# EAGLE design square Rev3 (EAGLE 9.0.1)
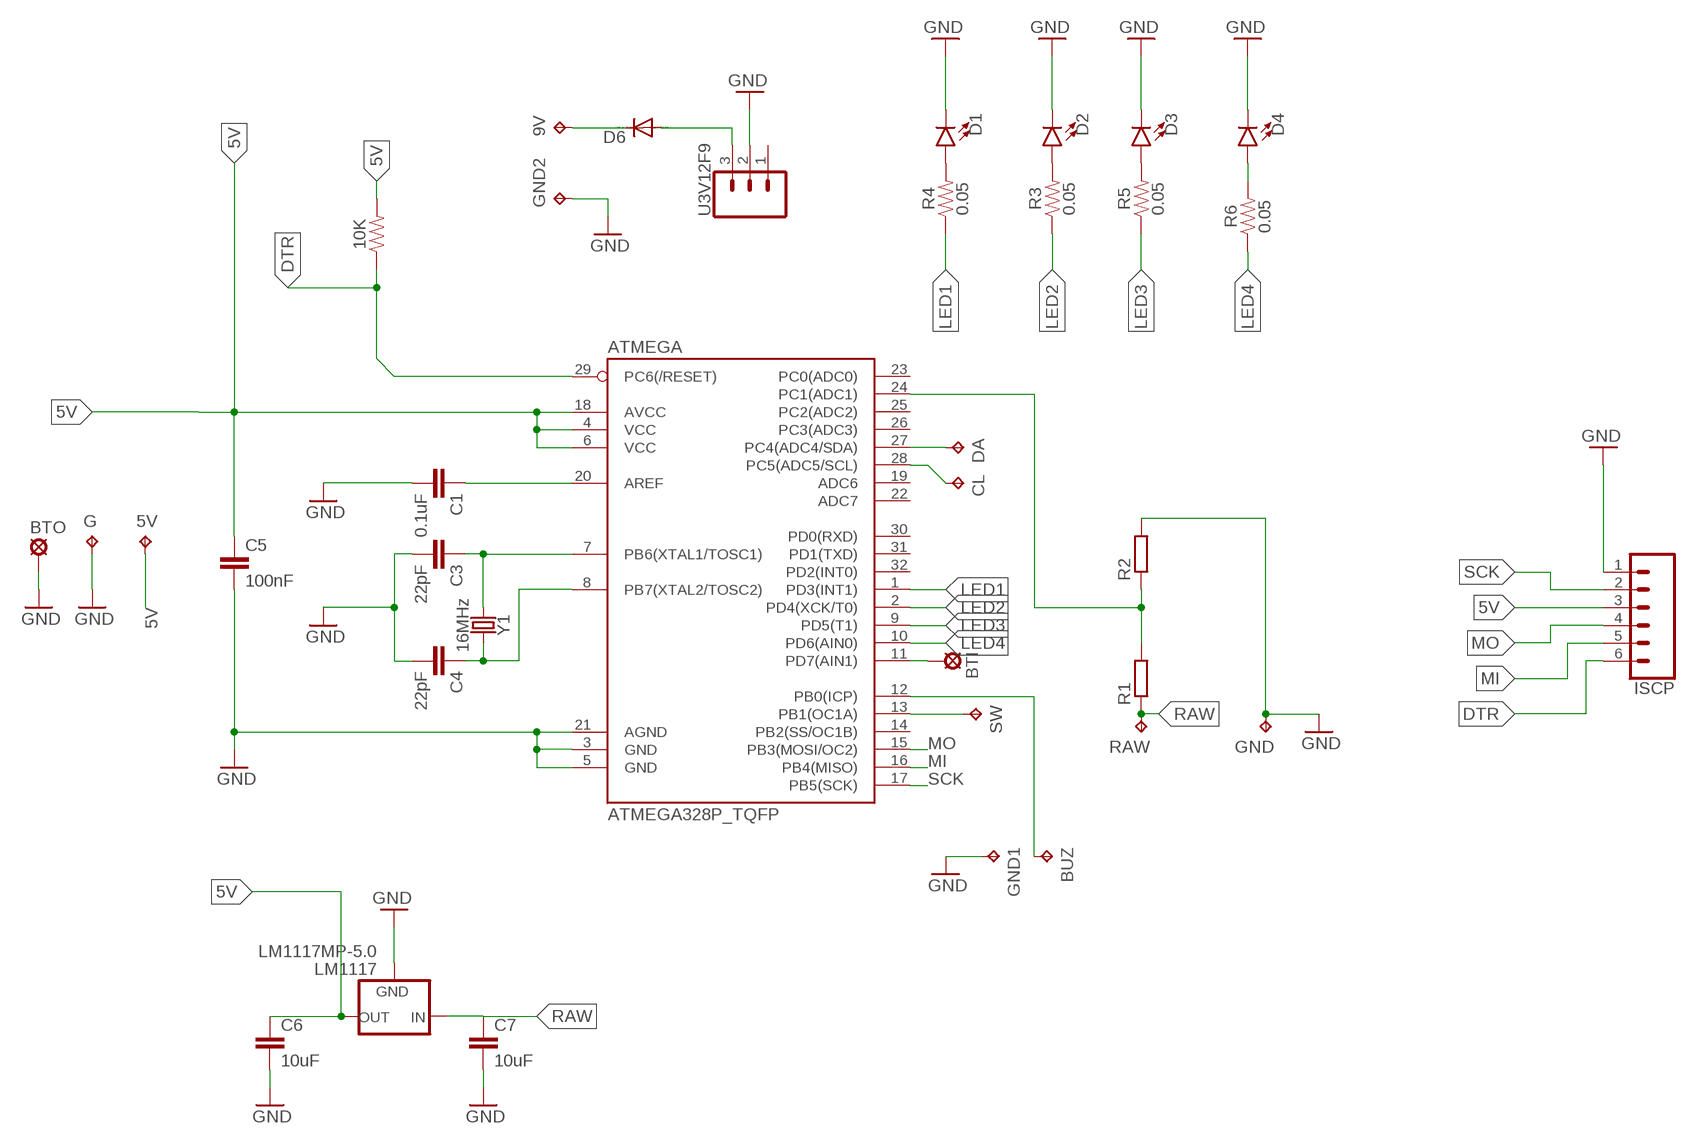
[diagram p0: schematic, sheet 1]

## Parts
5V  TPB1,27  [B1,27]
9V  TPB2,54  [B2,54]
10K  0.27OHM-0603-1/10W-1%  [0603]
ATMEGA  ATMEGA328P_TQFP  [TQFP32-08]
BTI  LSP10  [LSP10]
BTO  LSP10  [LSP10]
BUZ  TPB2,54  [B2,54]
C1  0.1uF  10NF-0603-50V-10%  [0603]
C3  22pF  10NF-0603-50V-10%  [0603]
C4  22pF  10NF-0603-50V-10%  [0603]
C5  100nF  10NF-0603-50V-10%  [0603]
C6  10uF  10UF-1206-6.3V-20%  [1206]
C7  10uF  C-EUC1206  [C1206]
CL  TPB1,27  [B1,27]
D1  LED1206  [LED-1206]
D2  LED1206  [LED-1206]
D3  LED1206  [LED-1206]
D4  LED1206  [LED-1206]
D6  DIODE-SOD106A-R  [SOD106A-R]
DA  TPB1,27  [B1,27]
G  TPB1,27  [B1,27]
GND  TPB2,54  [B2,54]
GND1  TPB2,54  [B2,54]
GND2  TPB2,54  [B2,54]
ISCP  CONN_06SMD-1MM  [1X06-1MM]
LM1117  LM1117MP-5.0  [SOT223]
R1  R-EU_R1206  [R1206]
R2  R-EU_R1206  [R1206]
R3  0.05  0.05OHM-0603-1/5W-1%  [0603]
R4  0.05  0.05OHM-0603-1/5W-1%  [0603]
R5  0.05  0.05OHM-0603-1/5W-1%  [0603]
R6  0.05  0.05OHM-0603-1/5W-1%  [0603]
RAW  TPB2,54  [B2,54]
SW  TPB1,27  [B1,27]
U3V12F9  CONN_03  [1X03]
Y1  16MHz  CRYSTALSMD-5X3.2-2PAD  [CRYSTAL-SMD-5X3.2-2PAD]

## Nets
5V [power]: 5V.TP 10K.2 ATMEGA.4(VCC) ATMEGA.6(VCC) ATMEGA.18(AVCC) C5.1 C6.1 ISCP.3 LM1117.2(OUT) LM1117.4(OUT)
9VOUT [9v]: D6.A U3V12F9.3
AREF: ATMEGA.20(AREF) C1.1
BUTTON: ATMEGA.11(PD7(AIN1)) BTI.MP
BUZZER: ATMEGA.12(PB0(ICP)) BUZ.TP
DTR: 10K.1 ATMEGA.29(PC6(/RESET)) ISCP.6
GND [power]: ATMEGA.3(GND) ATMEGA.5(GND) ATMEGA.21(AGND) BTO.MP C1.2 C3.2 C4.2 C5.2 C6.2 C7.2 D1.C D2.C D3.C D4.C G.TP GND1.TP GND2.TP GND.TP ISCP.1 LM1117.1(GND) R2.2 U3V12F9.2
GREEN1: D2.A R3.2
GREEN2: D3.A R5.2
GREEN3: D4.A R6.2
LED1: ATMEGA.1(PD3(INT1)) R4.1
LED2: ATMEGA.2(PD4(XCK/T0)) R3.1
LED3: ATMEGA.9(PD5(T1)) R5.1
LED4: ATMEGA.10(PD6(AIN0)) R6.1
MI: ATMEGA.16(PB4(MISO)) ISCP.5
MO: ATMEGA.15(PB3(MOSI/OC2)) ISCP.4
N$2: ATMEGA.13(PB1(OC1A)) SW.TP
N$21 [9v]: 9V.TP D6.C
RAW [9v]: C7.1 LM1117.3(IN) R1.1 RAW.TP
RED: D1.A R4.2
SCK: ATMEGA.17(PB5(SCK)) ISCP.2
SCL: ATMEGA.28(PC5(ADC5/SCL)) CL.TP
SDA: ATMEGA.27(PC4(ADC4/SDA)) DA.TP
VOLTSENS: ATMEGA.24(PC1(ADC1)) R1.2 R2.1
XTAL1: ATMEGA.7(PB6(XTAL1/TOSC1)) C3.1 Y1.P$1
XTAL2: ATMEGA.8(PB7(XTAL2/TOSC2)) C4.1 Y1.P$2
Unconnected: ATMEGA.14(PB2(SS/OC1B)) ATMEGA.19(ADC6) ATMEGA.22(ADC7) ATMEGA.23(PC0(ADC0)) ATMEGA.25(PC2(ADC2)) ATMEGA.26(PC3(ADC3)) ATMEGA.30(PD0(RXD)) ATMEGA.31(PD1(TXD)) ATMEGA.32(PD2(INT0)) U3V12F9.1

## Library data of the parts
5V 9V BUZ CL DA G GND GND1 GND2 RAW SW = testpad:TP: Test pad
10K = SparkFun-Resistors:0.27OHM: 0.27Ω resistor A resistor is a passive two-terminal electrical component that implements electrical resistance as a circuit element. Resistors act to reduce current flow, and, at the same time, act to lower voltage levels within circuits. - Wikipedia; PROD_ID: RES-08787; VALUE: 0.27
ATMEGA = SparkFun-IC-Microcontroller:ATMEGA328P_TQFP: Popular 328P in QFP Storefront component: ATmega328 - TQFP <https://www.sparkfun.com/products/13448> (COM-13448) Datasheet <http://www.sparkfun.com/datasheets/Components/SMD/ATMega328.pdf> SparkFun Products SparkFun RedBoard - Programmed with Arduino <https://www.sparkfun.com/products/12757> (DEV-12757) Arduino Pro Mini 328 - 5V/16MHz <https://www.sparkfun.com/products/11113> (DEV-11113) Arduino Pro Mini 328 - 3.3V/8MHz <https://www.sparkfun.com/products/11114> (DEV-11114) SparkFun OpenLog <https://www.sparkfun.com/products/13712> (DEV-13712) SparkFun MicroView - OLED Arduino Module <https://www.sparkfun.com/products/12923> (DEV-12923) SparkFun Digital Sandbox <https://www.sparkfun.com/products/12651> (DEV-12651) SparkFun PicoBoard <https://www.sparkfun.com/products/11888> (WIG-11888) Arduino Fio <https://www.sparkfun.com/products/10116> (DEV-10116) LilyPad Arduino 328 Main Board <https://www.sparkfun.com/products/13342> (DEV-13342) SparkFun RedStick <https://www.sparkfun.com/products/13741> (DEV-13741) LilyPad MP3 <https://www.sparkfun.com/products/11013> (DEV-11013) LilyPad Arduino SimpleSnap <https://www.sparkfun.com/products/10941> (DEV-10941) SparkFun Stepoko <https://www.sparkfun.com/products/13899> (ROB-13899) SparkFun Geiger Counter <https://www.sparkfun.com/products/11345> (SEN-11345) SparkFun EL Sequencer <https://www.sparkfun.com/products/12781> (COM-12781) Arduino Pro 328 - 5V/16MHz <https://www.sparkfun.com/products/10915> (DEV-10915) CryptoCape <https://www.sparkfun.com/products/12773> (DEV-12773) SparkFun IR Thermometer Evaluation Board - MLX90614 <https://www.sparkfun.com/products/10740> (SEN-10740) SparkFun RedBot Mainboard <https://www.sparkfun.com/products/12097> (ROB-12097) Arduino Pro 328 - 3.3V/8MHz <https://www.sparkfun.com/products/10914> (DEV-10914) SparkFun Block for Intel® Edison - Arduino <https://www.sparkfun.com/products/13036> (DEV-13036) SparkFun Simon Says - Surface Mount Soldering Kit <https://www.sparkfun.com/products/10935> (KIT-10935) SparkFun 7-Segment Serial Display - Red <https://www.sparkfun.com/products/11441> (COM-11441) SparkFun 7-Segment Serial Display - White <https://www.sparkfun.com/products/11629> (COM-11629) SparkFun 7-Segment Serial Display - Yellow <https://www.sparkfun.com/products/11443> (COM-11443) SparkFun 7-Segment Serial Display - Kelly Green <https://www.sparkfun.com/products/11440> (COM-11440) SparkFun 7-Segment Serial Display - Blue <https://www.sparkfun.com/products/11442> (COM-11442) SparkFun OpenSegment Serial Display - 20mm (Blue) <https://www.sparkfun.com/products/11647> (COM-11647) SparkFun OpenSegment Serial Display - 20mm (Green) <https://www.sparkfun.com/products/11646> (COM-11646) SparkFun OpenSegment Serial Display - 20mm (White) <https://www.sparkfun.com/products/11648> (COM-11648) SparkFun OpenSegment Serial Display - 20mm (Red) <https://www.sparkfun.com/products/11644> (COM-11644) SparkFun OpenSegment Serial Display - 20mm (Yellow) <https://www.sparkfun.com/products/11645> (COM-11645) SparkFun OpenSegment Shield <https://www.sparkfun.com/products/13190> (DEV-13190); PROD_ID: IC-09069
BTI BTO = solpad:LSP10: SOLDER PAD drill 1.0 mm, distributor Buerklin, 12H555
C1 C3-C5 = SparkFun-Capacitors:10NF: 0.01uF/10nF/10,000pF ceramic capacitors A capacitor is a passive two-terminal electrical component used to store electrical energy temporarily in an electric field. CAP-09321; PROD_ID: CAP-00867; VALUE: 10nF
C6 = SparkFun-Capacitors:10UF: 10.0µF ceramic capacitors A capacitor is a passive two-terminal electrical component used to store electrical energy temporarily in an electric field.; PROD_ID: CAP-10057
C7 = rcl:C-EU: CAPACITOR, European symbol; SPICEPREFIX: C
D1-D4 = SparkFun-LED:LED: LED (Generic) Standard schematic elements and footprints for 5mm, 3mm, 1206, and 0603 sized LEDs. Generic LEDs with no color specified.
D6 = diode:DIODE-: DIODE
ISCP = SparkFun-Connectors:CONN_06: Multi connection point. Often used as Generic Header-pin footprint for 0.1 inch spaced/style header connections On any of the 0.1 inch spaced packages, you can populate with these: Break Away Headers - Straight <https://www.sparkfun.com/products/116> (PRT-00116) Break Away Male Headers - Right Angle <https://www.sparkfun.com/products/553> (PRT-00553) Female Headers <https://www.sparkfun.com/products/115> (PRT-00115) Break Away Headers - Machine Pin <https://www.sparkfun.com/products/117> (PRT-00117) Break Away Female Headers - Swiss Machine Pin <https://www.sparkfun.com/products/743> (PRT-00743) Arduino Stackable Header - 6 Pin <https://www.sparkfun.com/products/9280> (PRT-09280) For SCREWTERMINALS and SPRING TERMINALS visit here: Screw Terimnals on SparkFun.com <https://www.sparkfun.com/search/results?term=Screw+Terminals> (5mm/3.5mm/2.54mm spacing) This device is also useful as a general connection point to wire up your design to another part of your project. Our various solder wires solder well into these plated through hole pads. Hook-Up Wire - Assortment (Stranded, 22 AWG) <https://www.sparkfun.com/products/11375> (PRT-11375) Hook-Up Wire - Assortment (Solid Core, 22 AWG) <https://www.sparkfun.com/products/11367> (PRT-11367) View the entire wire category on our website here <https://www.sparkfun.com/categories/141>; PROD_ID: CONN-08249; SF_ID: GPS-00579
LM1117 = lm1117_10:LM1117?-*: 800mA Low-Dropout Linear Regulator Source: http://www.ti.com/lit/ds/symlink/lm1117-n.pdf; MF: Texas Instruments; MPN: LM1117MP-5.0; OC_FARNELL: 9778209; OC_NEWARK: 28X3417
R1 R2 = Clean-Kong:R-EU_: RESISTOR, European symbol
R3-R6 = SparkFun-Resistors:0.05OHM: 0.05Ω resistor A resistor is a passive two-terminal electrical component that implements electrical resistance as a circuit element. Resistors act to reduce current flow, and, at the same time, act to lower voltage levels within circuits. - Wikipedia; PROD_ID: RES-12535
U3V12F9 = SparkFun-Connectors:CONN_03: Multi connection point. Often used as Generic Header-pin footprint for 0.1 inch spaced/style header connections On any of the 0.1 inch spaced packages, you can populate with these: Break Away Headers - Straight <https://www.sparkfun.com/products/116> (PRT-00116) Break Away Male Headers - Right Angle <https://www.sparkfun.com/products/553> (PRT-00553) Female Headers <https://www.sparkfun.com/products/115> (PRT-00115) Break Away Headers - Machine Pin <https://www.sparkfun.com/products/117> (PRT-00117) Break Away Female Headers - Swiss Machine Pin <https://www.sparkfun.com/products/743> (PRT-00743) Stackable Header - 3 Pin (Female, 0.1") <https://www.sparkfun.com/products/13875> (PRT-13875) For SCREWTERMINALS and SPRING TERMINALS visit here: Screw Terimnals on SparkFun.com <https://www.sparkfun.com/search/results?term=Screw+Terminals> (5mm/3.5mm/2.54mm spacing) This device is also useful as a general connection point to wire up your design to another part of your project. Our various solder wires solder well into these plated through hole pads. Hook-Up Wire - Assortment (Stranded, 22 AWG) <https://www.sparkfun.com/products/11375> (PRT-11375) Hook-Up Wire - Assortment (Solid Core, 22 AWG) <https://www.sparkfun.com/products/11367> (PRT-11367) View the entire wire category on our website here <https://www.sparkfun.com/categories/141> Special notes: Molex polarized connector foot print use with SKU : PRT-08232 with associated crimp pins and housings.
Y1 = SparkFun-Clocks:CRYSTAL: Crystals (Generic) These are passive quartz crystals, which can be used as a clock source for a microcontroller. Crystal's are two-terminal devices. They require external "load" capacitors to generate an oscillating signal.

## Module VCC
Ports: 

### Library data of the parts

## Net classes
0 default: width 0.254 mm, drill 0.254 mm, clearance 0.229 mm
1 power: width 0.305 mm, drill 0.3 mm, clearance 0.305 mm
2 9v: width 0.399 mm, drill 0.399 mm, clearance 0.3 mm

## Board
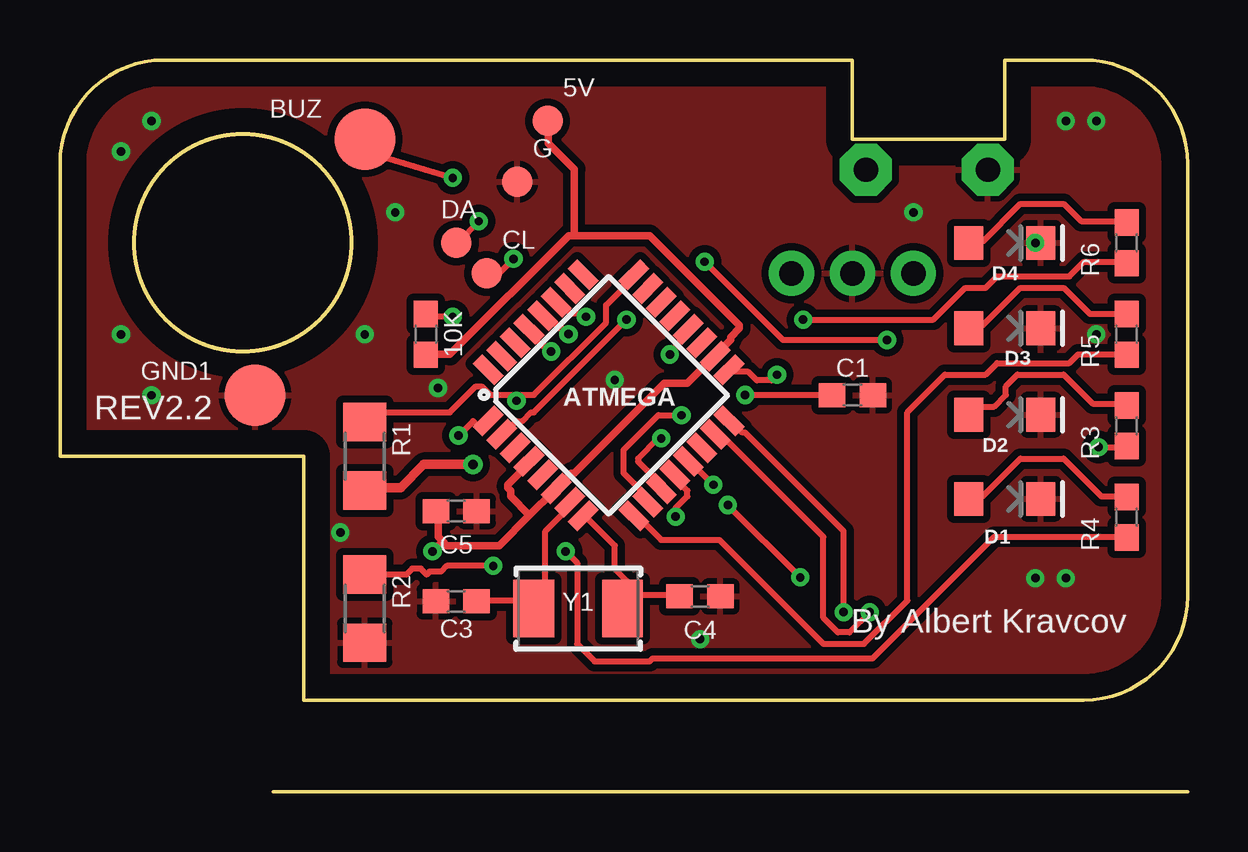
[diagram p1: board, top side]
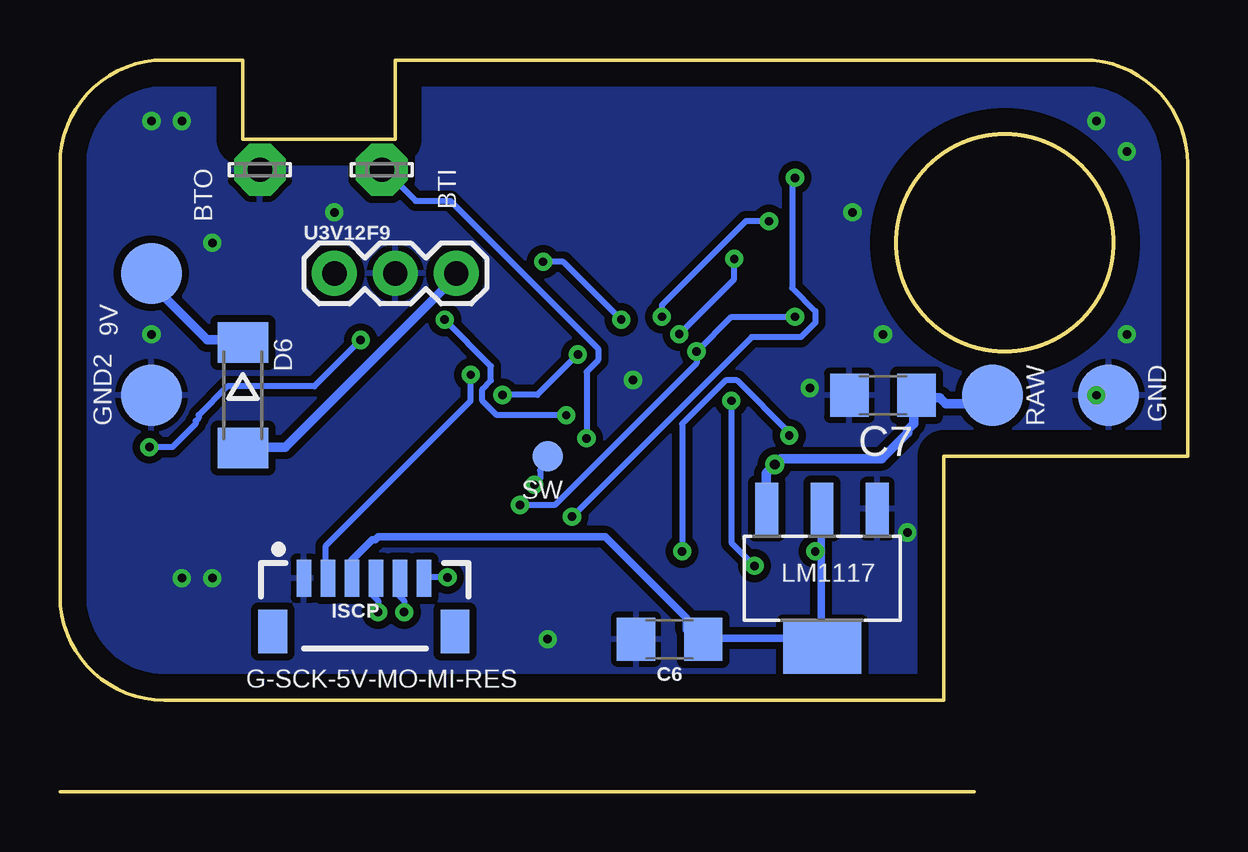
[diagram p2: board, bottom side, seen from below]

Size 46.99 x 30.48 mm. Coordinates in mm from the lower left corner, seen from the top.
Outline: 0,13.97 0,26.14 arc-90 4.34,30.48 33.02,30.48 33.02,27.18 39.37,27.18 39.37,30.48 42.65,30.48 arc-90 46.99,26.14 46.99,8.15 arc-90 42.65,3.81 10.16,3.81 10.16,13.97 0,13.97
Outline: circle at 7.62,22.86 radius 4.52
Copper layers (1*16): Top 0.035mm / dielectric 1.5mm / Bottom 0.035mm
Design rules "default *": minimum track width 6mil, minimum drill 0.35mm, track to track 6mil, track to pad 6mil, pad to pad 6mil, via to via 6mil, smd to smd 6mil, copper to edge 40mil, drill to drill 6mil, minimum pad ring 10mil, minimum via ring 8mil, stop-mask expansion 4mil, vias tented up to drill 2mm, thermal gap 10mil

### Footprints (pad centres in the part's own frame; a part is rotated, then mirrored left to right if it is on the bottom)
B1,27 = smd 1.27 x 1.27: TP 0,0
B2,54 = smd 2.54 x 2.54: TP 0,0
0603 = smd 1.1 x 1: 1 -0.85,0; 2 0.85,0
TQFP32-08 = smd 1.27 x 0.559: 1 -4.293,2.8; 2 -4.293,2; 3 -4.293,1.2; 4 -4.293,0.4; 5 -4.293,-0.4; 6 -4.293,-1.2; 7 -4.293,-2; 8 -4.293,-2.8; 17 4.293,-2.8; 18 4.293,-2; 19 4.293,-1.2; 20 4.293,-0.4; 21 4.293,0.4; 22 4.293,1.2; 23 4.293,2; 24 4.293,2.8 | smd 0.559 x 1.27: 9 -2.8,-4.293; 10 -2,-4.293; 11 -1.2,-4.293; 12 -0.4,-4.293; 13 0.4,-4.293; 14 1.2,-4.293; 15 2,-4.293; 16 2.8,-4.293; 25 2.8,4.293; 26 2,4.293; 27 1.2,4.293; 28 0.4,4.293; 29 -0.4,4.293; 30 -1.2,4.293; 31 -2,4.293; 32 -2.8,4.293
LSP10 = drill 1.016 pad 2.159 octagon: MP 0,0
1206 = smd 1.6 x 1.8: 1 -1.4,0; 2 1.4,0
C1206 = smd 1.6 x 1.8: 1 -1.4,0; 2 1.4,0
LED-1206 = smd 1.2 x 1.4: A -1.5,0; C 1.5,0
SOD106A-R = smd 1.7 x 2.1: A 2.2,0; C -2.2,0
1X06-1MM = smd 0.6 x 1.55: 1 -2.54,1.27; 2 -1.54,1.27; 3 -0.54,1.27; 4 0.46,1.27; 5 1.46,1.27; 6 2.46,1.27 | smd 1.2 x 1.8: P$1 -3.84,-0.955; P$2 3.76,-0.955
SOT223 = smd 0.95 x 2.15: 1 -2.3,-2.9; 2 0,-2.9; 3 2.3,-2.9 | smd 3.25 x 2.15: 4 0,2.9
R1206 = smd 1.6 x 1.803: 1 -1.422,0; 2 1.422,0
1X03 = drill 1.016 pad 1.88: 1 0,0; 2 2.54,0; 3 5.08,0
CRYSTAL-SMD-5X3.2-2PAD = smd 1.7 x 2.4: P$1 1.85,0; P$2 -1.85,0

### Placement (x,y rotation side)
5V  20.32,27.94 0 top
9V  43.18,21.59 0 bottom
10K  15.24,19.05 270 top
ATMEGA  22.86,16.51 45 top
BTI  33.58,25.91 0 bottom
BTO  38.66,25.91 0 bottom
BUZ  12.7,27.18 90 top
C1  33.02,16.51 0 top
C3  16.51,7.92 180 top
C4  26.67,8.13 0 top
C5  16.51,11.68 0 top
C6  21.59,6.35 180 bottom
C7  12.7,16.51 180 bottom
CL  17.78,21.59 0 top
D1  39.37,12.19 0 top
D2  39.37,15.7 0 top
D3  39.37,19.3 0 top
D4  39.37,22.86 0 top
D6  39.37,16.51 270 bottom
DA  16.51,22.86 0 top
G  19.05,25.4 0 top
GND  3.3,16.51 0 bottom
GND1  8.13,16.51 90 top
GND2  43.18,16.51 0 bottom
ISCP  34.29,7.62 0 bottom
LM1117  15.24,8.89 180 bottom
R1  12.7,13.97 90 top
R2  12.7,7.62 270 top
R3  44.45,15.24 90 top
R4  44.45,11.43 90 top
R5  44.45,19.05 90 top
R6  44.45,22.86 90 top
RAW  8.13,16.51 180 bottom
SW  26.67,13.97 180 bottom
U3V12F9  35.56,21.59 0 bottom
Y1  21.59,7.62 180 top

### Tracks (layer width: path | path; a pad name or v marks a point on that pad's centre or on a via)
5V  (via drill 0.35)
  Top 0.305: 15.94,10.43 16.12,10.25 18.29,10.25 19.56,11.52 | 15.94,10.43 15.76,10.61 15.76,11.58 C5.1 | 19.56,11.52 20.59,12.54 ATMEGA.6 20.71,12.66 21.31,13.27 21.43,13.27 25.17,17.01 26.14,17.01 27.22,18.09 ATMEGA.18 27.34,18.21 27.95,18.82 27.95,18.94 28.31,19.3 28.31,19.42 24.57,23.16 21.43,23.16 | 19.56,11.52 18.78,12.3 18.78,12.54 18.66,12.66 18.66,12.78 19.26,13.39 19.26,13.51 19.5,13.75 ATMEGA.4 | 21.43,23.16 21.19,23.16 16.24,18.21 15.28,18.21 10K.2 | v15.52,10.01 15.94,10.43 | 21.43,23.16 21.43,25.93 20.34,27.02 20.34,27.86 5V.TP
  Bottom 0.305: ISCP.3 34.82,8.92 34.82,9.65 33.98,10.49 33.86,10.49 33.74,10.61 24.27,10.61 20.89,7.23 20.89,6.75 20.65,6.51 C6.1 19.38,6.39 15.64,6.39 15.28,6.03 LM1117.4 15.64,6.51 15.28,6.87 15.28,10.01 | 15.28,10.01 15.28,11.7 LM1117.2 | v15.52,10.01 15.28,10.01
9VOUT
  Bottom 0.399: U3V12F9.3 30.48,21.47 37.6,14.35 39.29,14.35 D6.A
AREF  (via drill 0.35)
  Top 0.254: v28.55,16.52 32.17,16.52 C1.1 | v25.41,18.21 25.65,18.45 25.65,18.57 26.26,19.18 ATMEGA.20
  Bottom 0.254: v28.55,16.52 27.1,16.52 v25.41,18.21
BUTTON  (via drill 0.35)
  Top 0.254: v25.05,14.71 24.93,14.71 24.09,13.87 24.09,13.75 24.93,12.9 24.93,12.66 ATMEGA.11
  Bottom 0.254: v25.05,14.71 25.05,17.49 24.57,17.97 24.57,18.45 30.72,24.61 32.17,24.61 33.5,25.93 BTI.MP
BUZZER  (via drill 0.35)
  Top 0.254: v25.65,11.45 25.65,11.82 26.14,12.3 26.14,12.54 25.9,12.78 25.9,12.9 25.65,13.14 ATMEGA.12 | v16.36,25.57 12.74,26.66 12.74,27.14 BUZ.TP
  Bottom 0.254: v25.65,11.45 18.17,18.94 16.12,18.94 15.52,19.54 15.52,20.02 16.48,20.99 16.48,25.45 v16.36,25.57
DTR  (via drill 0.35)
  Top 0.254: v16.36,19.78 15.28,19.78 10K.1 | v20.47,18.33 20.23,18.57 20.1,18.57 19.5,19.18 ATMEGA.29 | v27.83,11.94 v30.84,8.92
  Bottom 0.254: v16.36,19.78 19.02,19.78 v20.47,18.33 20.47,17.85 26.38,11.94 v27.83,11.94 | v30.84,8.92 31.81,8.92 ISCP.6
GND  (via drill 0.35)
  other vias: 26.67,6.35 11.68,10.8 2.54,19.05 2.54,26.67 13.97,24.13 15.75,16.81 41.91,8.89 40.64,8.89 43.18,19.05 40.64,22.86 41.91,27.94 43.18,27.94 35.56,24.13 23.11,17.14 12.7,19.05 3.81,27.94 3.81,16.51
  pour Top: -5.08,33.02 53.34,33.02 53.34,-2.54 -5.08,-2.54
  pour Bottom: -3.81,-2.54 -3.81,40.64 50.8,40.64 50.8,-2.54
GREEN1
  Top 0.254: R3.2 44.36,16.16 43.03,16.16 41.82,17.37 39.89,17.37 39.41,16.89 39.41,16.52 38.93,16.04 38.2,16.04 37.96,15.8 D2.A
GREEN2
  Top 0.254: R5.2 44.36,19.9 42.91,19.9 41.82,20.99 40.01,20.99 38.44,19.42 37.96,19.42 D3.A
GREEN3
  Top 0.254: R6.2 44.36,23.76 42.55,23.76 41.82,24.49 40.01,24.49 38.44,22.92 37.96,22.92 D4.A
LED1  (via drill 0.35)
  Top 0.254: v21.07,10.01 21.55,9.52 21.55,6.15 22.28,5.42 24.57,5.42 24.69,5.54 33.86,5.54 38.93,10.61 44.36,10.61 R4.1 | v16.61,14.83 17.21,15.44 17.45,15.2 17.57,15.2 17.81,15.44 ATMEGA.1
  Bottom 0.254: v21.07,10.01 21.07,15.32 19.26,17.13 18.78,17.13 16.61,14.95 v16.61,14.83
LED2  (via drill 0.35)
  Top 0.254: v43.27,14.35 44.36,14.35 R3.1 | v34.46,18.82 30.12,18.82 v26.86,22.07 | v23.6,19.66 19.74,15.8 19.62,15.8 19.26,15.44 19.02,15.44 18.41,14.83 ATMEGA.2
  Bottom 0.254: v43.27,14.35 42.3,14.35 41.34,15.32 41.34,15.44 41.22,15.56 41.22,15.68 40.01,16.89 36.39,16.89 v34.46,18.82 | v26.86,22.07 26.02,22.07 v23.6,19.66
LED3
  Top 0.254: R5.1 44.36,18.21 42.42,18.21 42.06,17.85 39.05,17.85 38.56,17.37 36.87,17.37 35.31,15.8 35.31,7.96 33.5,6.15 31.81,6.15 27.46,10.49 25.05,10.49 23.96,11.58 ATMEGA.9
LED4  (via drill 0.35)
  Top 0.254: v30.96,19.66 36.39,19.66 37.72,20.99 38.56,20.99 39.05,21.47 42.06,21.47 42.67,22.07 44.36,22.07 R6.1 | v25.9,15.68 24.93,15.68 23.48,14.23 23.48,13.27 24.57,12.18 ATMEGA.10
  Bottom 0.254: v30.96,19.66 29.03,17.73 29.03,17.13 29.39,16.76 29.39,16.28 28.79,15.68 v25.9,15.68
MI  (via drill 0.35)
  Top 0.254: v32.65,7.47 32.65,10.85 28.55,14.95 28.43,14.95 27.95,15.44 ATMEGA.16
  Bottom 0.254: v32.65,7.47 32.65,7.96 32.89,8.2 32.89,8.8 ISCP.5
MO  (via drill 0.35)
  Top 0.254: v33.74,7.47 32.89,6.63 32.41,6.63 31.81,7.23 31.81,10.61 27.58,14.83 27.34,14.83 ATMEGA.15
  Bottom 0.254: v33.74,7.47 33.74,7.96 33.98,8.2 33.98,8.68 33.86,8.8 ISCP.4
N$2  (via drill 0.35)
  Top 0.254: v27.22,12.78 26.26,13.75 ATMEGA.13
  Bottom 0.254: v27.22,12.78 26.98,13.02 26.98,13.39 26.74,13.63 26.74,13.87 SW.TP
N$21
  Bottom 0.399: D6.C 39.41,18.82 40.86,18.82 43.15,21.11 43.15,21.59 9V.TP
RAW  (via drill 0.4)
  Top 0.399: v17.21,13.63 15.16,13.63 14.19,12.66 12.74,12.66 R1.1
  Bottom 0.399: RAW.TP 8.16,16.4 8.4,16.16 10.09,16.16 10.33,16.4 11.3,16.4 C7.1 11.42,16.28 11.42,15.32 11.66,15.07 11.66,14.95 12.74,13.87 16.97,13.87 v17.21,13.63 17.57,13.27 17.57,11.82 LM1117.3
RED
  Top 0.254: R4.2 44.36,12.3 43.39,12.3 41.82,13.87 40.01,13.87 38.44,12.3 37.96,12.3 D1.A
SCK  (via drill 0.35)
  Top 0.254: v29.88,17.37 29.63,17.13 29.03,17.13 28.67,17.49 27.95,17.49 ATMEGA.17
  Bottom 0.254: v29.88,17.37 29.88,16.28 35.91,10.25 35.91,8.92 ISCP.2
SCL  (via drill 0.35)
  Top 0.254: CL.TP 18.29,21.59 v18.9,22.19 | v21.19,19.06 20.95,19.3 20.83,19.3 20.23,19.9 ATMEGA.28
  Bottom 0.254: v18.9,22.19 18.9,21.35 v21.19,19.06
SDA  (via drill 0.35)
  Top 0.254: v21.91,19.78 21.79,19.9 21.31,19.9 21.07,20.14 20.95,20.14 20.71,20.38 ATMEGA.27 | v17.45,23.76 16.61,22.92 DA.TP
  Bottom 0.254: v21.91,19.78 21.91,20.26 18.41,23.76 v17.45,23.76
VOLTSENS  (via drill 0.35)
  Top 0.254: 19.02,16.52 17.93,16.52 17.57,16.89 17.33,16.89 16.24,15.8 13.11,15.8 12.74,15.44 R1.2 | 19.02,16.52 19.74,16.52 22.76,19.54 22.76,20.26 23.48,20.99 23.48,21.11 23.84,21.47 ATMEGA.24 | v18.05,9.4 16.12,9.4 15.88,9.16 15.4,9.16 15.28,9.04 15.04,9.28 14.67,9.28 14.43,9.04 12.74,9.04 R2.1 | v19.02,16.28 19.02,16.52
  Bottom 0.254: v18.05,9.4 19.02,10.37 v19.02,16.28
XTAL1
  Top 0.254: C3.1 17.45,7.96 19.38,7.96 19.62,7.72 Y1.P$1 19.5,7.96 20.23,8.68 20.23,10.85 21.19,11.82 21.19,12.06 ATMEGA.7
XTAL2
  Top 0.254: C4.1 25.77,8.2 23.96,8.2 23.48,7.72 Y1.P$2 24.09,8.32 23.12,9.28 23.12,10.25 21.91,11.45 ATMEGA.8

### Text on the board
tPlace: REV2.2 | By Albert Kravcov
bPlace: G-SCK-5V-MO-MI-RES